# EAGLE design LPC1114FN28_BaseBoard (EAGLE 5.11)
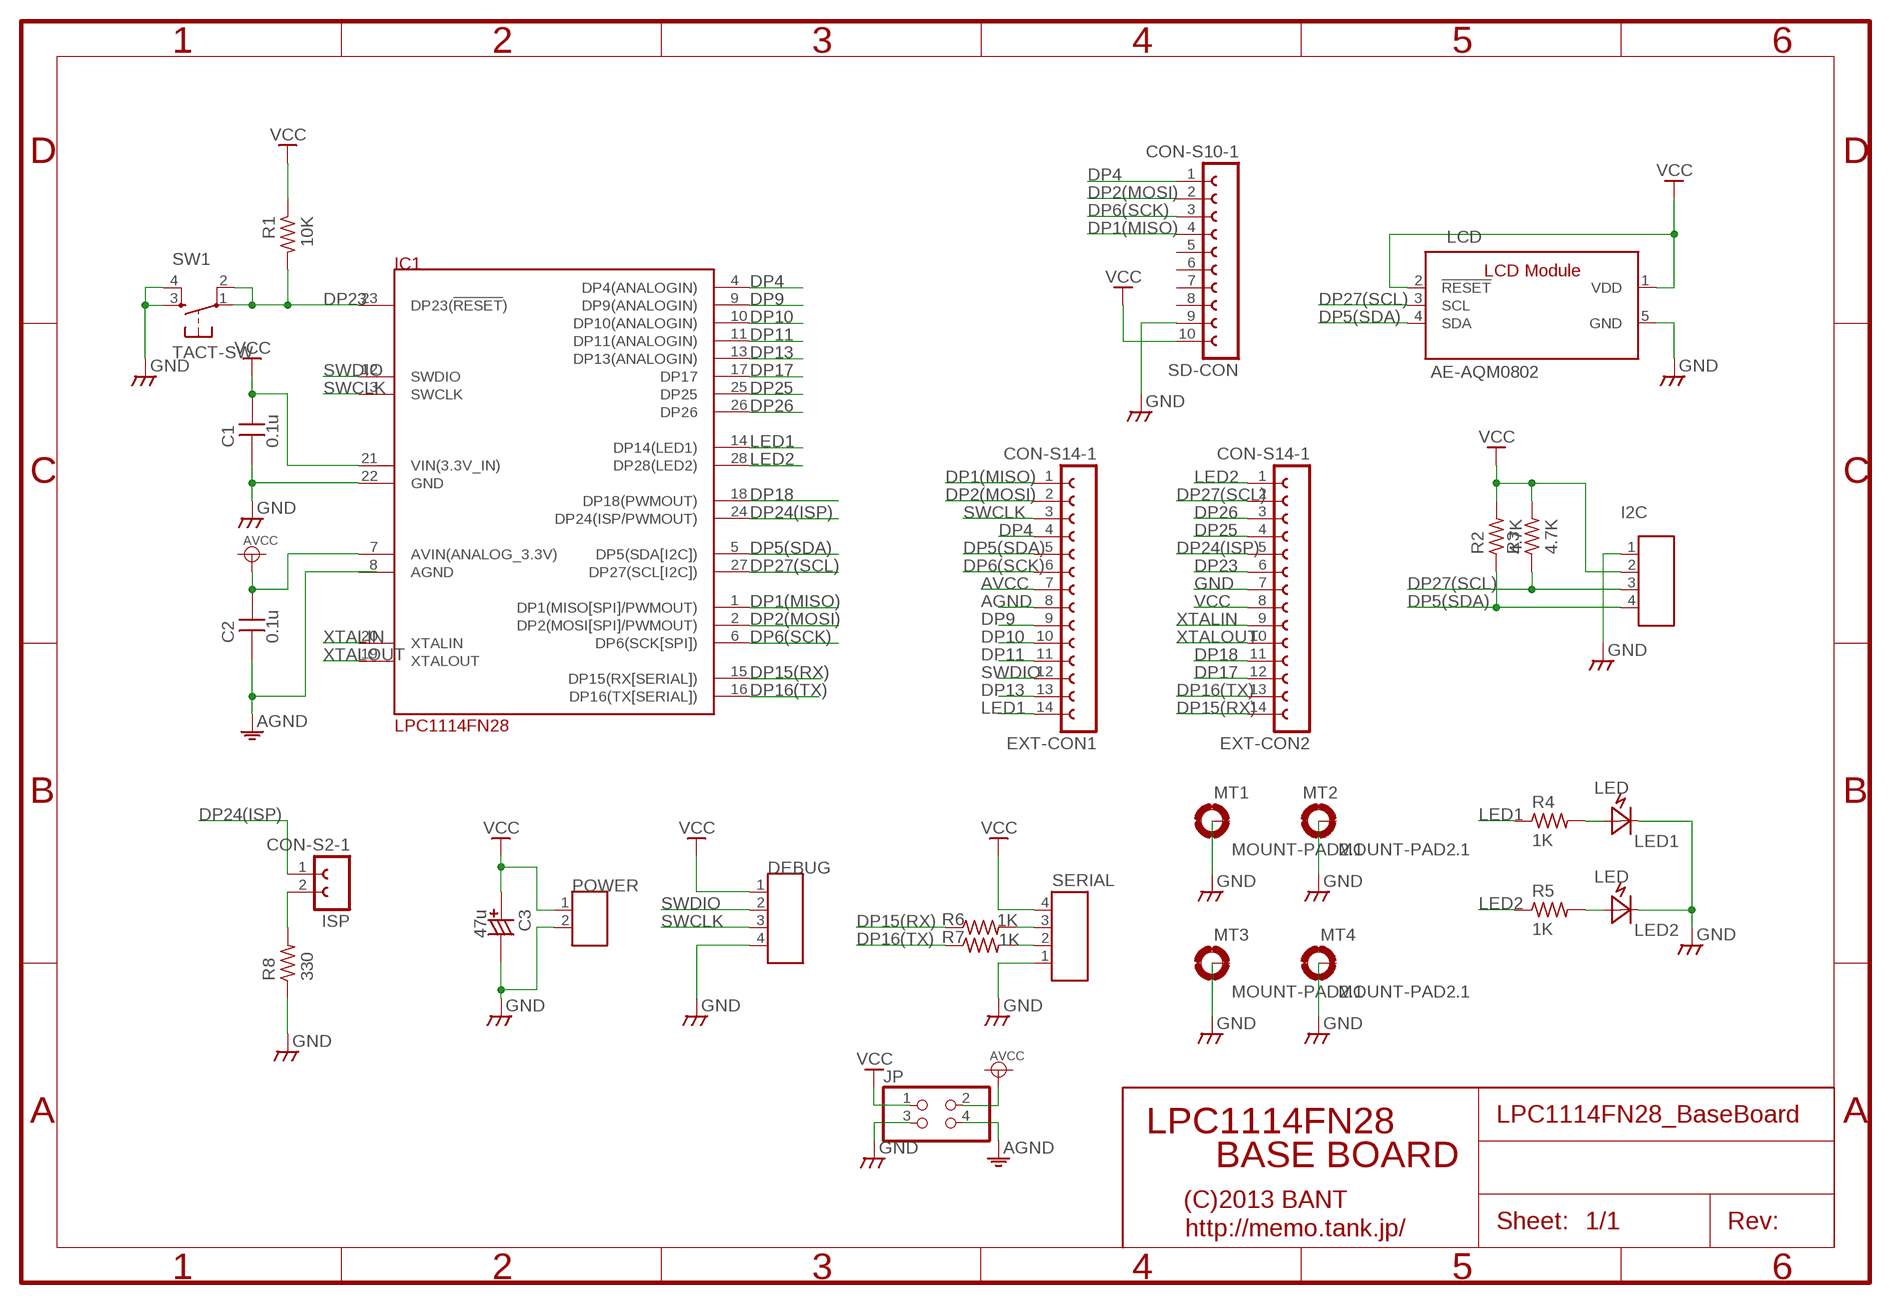
[diagram p0: schematic, sheet 1]

## Parts
C1  0.1u  CAPDIP_1  [CAP_DIP_1]
C2  0.1u  CAPDIP_1  [CAP_DIP_1]
C3  47u  CCAP6.5  [CCAP_6.5]
DEBUG  CON_4P  [CON_HRS_DIP_4]
EXT-CON1  CON-S14-1  [CON-S14-1]
EXT-CON2  CON-S14-1  [CON-S14-1]
I2C  CON_4P  [CON_HRS_DIP_4]
IC1  LPC1114FN28  [DIL28]
ISP  CON-S2-1  [CON-S2-1]
JP  PINHD-2X02_2.54  [2X02]
LCD  AE-AQM0802  [AE-AQM0802]
LED1  LED  [LED_3MM_VIRT_2]
LED2  LED  [LED_3MM_VIRT_2]
MT1  MOUNT-PAD2.1  [PAD-2.1]
MT2  MOUNT-PAD2.1  [PAD-2.1]
MT3  MOUNT-PAD2.1  [PAD-2.1]
MT4  MOUNT-PAD2.1  [PAD-2.1]
POWER  CON_2P  [CON_HRS_DIP_2]
R1  10K  R0.125W_4P  [R_0.125W_4]
R2  4.7K  R0.125W_4P  [R_0.125W_4]
R3  4.7K  R0.125W_4P  [R_0.125W_4]
R4  1K  R0.125W_4P  [R_0.125W_4]
R5  1K  R0.125W_4P  [R_0.125W_4]
R6  1K  R0.125W_4P  [R_0.125W_4]
R7  1K  R0.125W_4P  [R_0.125W_4]
R8  330  R0.125W_4P  [R_0.125W_4]
SD-CON  CON-S10-1  [CON-S10-1]
SERIAL  CON_4P  [CON_HRS_DIP_4]
SW1  TACT-SW  [B3F-10X]

## Nets
AGND: C2.1 EXT-CON1.8 IC1.8(AGND) JP.4
AVCC: C2.2 EXT-CON1.7 IC1.7(AVIN(ANALOG_3.3V)) JP.2
DP1(MISO): EXT-CON1.1 IC1.1(DP1(MISO[SPI]/PWMOUT)) SD-CON.4
DP2(MOSI): EXT-CON1.2 IC1.2(DP2(MOSI[SPI]/PWMOUT)) SD-CON.2
DP4: EXT-CON1.4 IC1.4(DP4(ANALOGIN)) SD-CON.1
DP5(SDA): EXT-CON1.5 I2C.4 IC1.5(DP5(SDA[I2C])) LCD.4(SDA) R2.1
DP6(SCK): EXT-CON1.6 IC1.6(DP6(SCK[SPI])) SD-CON.3
DP9: EXT-CON1.9 IC1.9(DP9(ANALOGIN))
DP10: EXT-CON1.10 IC1.10(DP10(ANALOGIN))
DP11: EXT-CON1.11 IC1.11(DP11(ANALOGIN))
DP13: EXT-CON1.13 IC1.13(DP13(ANALOGIN))
DP15(RX): EXT-CON2.14 IC1.15(DP15(RX[SERIAL])) R6.1
DP16(TX): EXT-CON2.13 IC1.16(DP16(TX[SERIAL])) R7.1
DP17: EXT-CON2.12 IC1.17(DP17)
DP18: EXT-CON2.11 IC1.18(DP18(PWMOUT))
DP23: EXT-CON2.6 IC1.23(DP23(!RESET!)) R1.2 SW1.1(P) SW1.2(P1)
DP24(ISP): EXT-CON2.5 IC1.24(DP24(ISP/PWMOUT)) ISP.1
DP25: EXT-CON2.4 IC1.25(DP25)
DP26: EXT-CON2.3 IC1.26(DP26)
DP27(SCL): EXT-CON2.2 I2C.3 IC1.27(DP27(SCL[I2C])) LCD.3(SCL) R3.1
GND: C1.1 C3.- DEBUG.4 EXT-CON2.7 I2C.1 IC1.22(GND) JP.3 LCD.5(GND) LED1.K LED2.K MT1.B2,1(MOUNT) MT2.B2,1(MOUNT) MT3.B2,1(MOUNT) MT4.B2,1(MOUNT) POWER.2 R8.1 SD-CON.9 SERIAL.1 SW1.3(S) SW1.4(S1)
LED1: EXT-CON1.14 IC1.14(DP14(LED1)) R4.1
LED2: EXT-CON2.1 IC1.28(DP28(LED2)) R5.1
N$2: R6.2 SERIAL.3
N$3: LED1.A R4.2
N$4: LED2.A R5.2
N$5: R7.2 SERIAL.2
N$6: ISP.2 R8.2
SWCLK: DEBUG.3 EXT-CON1.3 IC1.3(SWCLK)
SWDIO: DEBUG.2 EXT-CON1.12 IC1.12(SWDIO)
VCC: C1.2 C3.+ DEBUG.1 EXT-CON2.8 I2C.2 IC1.21(VIN(3.3V_IN)) JP.1 LCD.1(VDD) LCD.2(!RESET) POWER.1 R1.1 R2.2 R3.2 SD-CON.10 SERIAL.4
XTALIN: EXT-CON2.9 IC1.20(XTALIN)
XTALOUT: EXT-CON2.10 IC1.19(XTALOUT)
Unconnected: SD-CON.5 SD-CON.6 SD-CON.7 SD-CON.8

## Notes on the sheet
- LPC1114FN28
- BASE BOARD
- (C)2013 BANT
- http://memo.tank.jp/

## Library data of the parts
C1 C2 = MyLib:CAP: Non polar capacitor
C3 = MyLib:CCAP: Polar capacitor
DEBUG I2C SERIAL = MyLib:CON_4P: 4P Molex Connector
EXT-CON1 EXT-CON2 = bant:CON-S14-1
IC1 = bant:LPC1114FN28
ISP = bant:CON-S2-1
JP = pinheader:PINHD-2X02: PIN HEADER
LCD = akizuki:AE-AQM0802
LED1 LED2 = MyLib:LED: 3mm LED
MT1-MT4 = MyLib:MOUNT-PAD: 2.1mm Mount Pad (Connectable to GND)
POWER = MyLib:CON_2P: 2P Molex Connector
R1-R8 = MyLib:R: General Resiter 1/8W 1/4W 1/2W V/H
SD-CON = bant:CON-S10-1
SW1 = MyLib:TACT-SW: Tacticle Push Switch

## Board
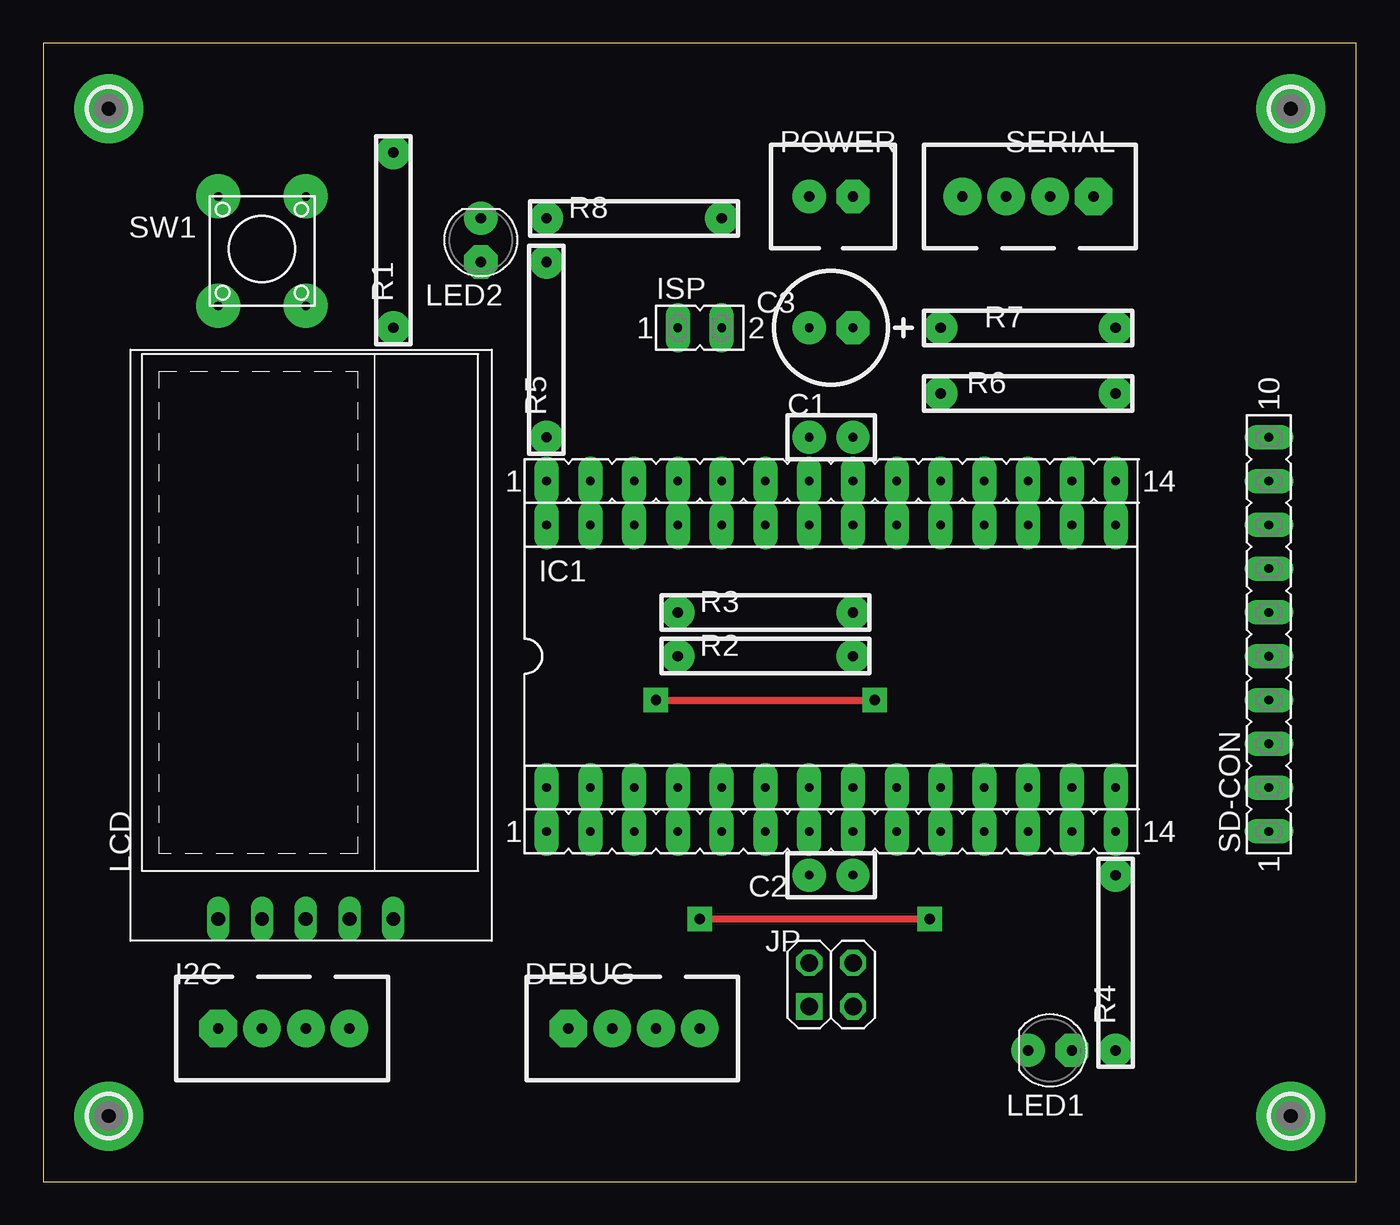
[diagram p1: board, top side]
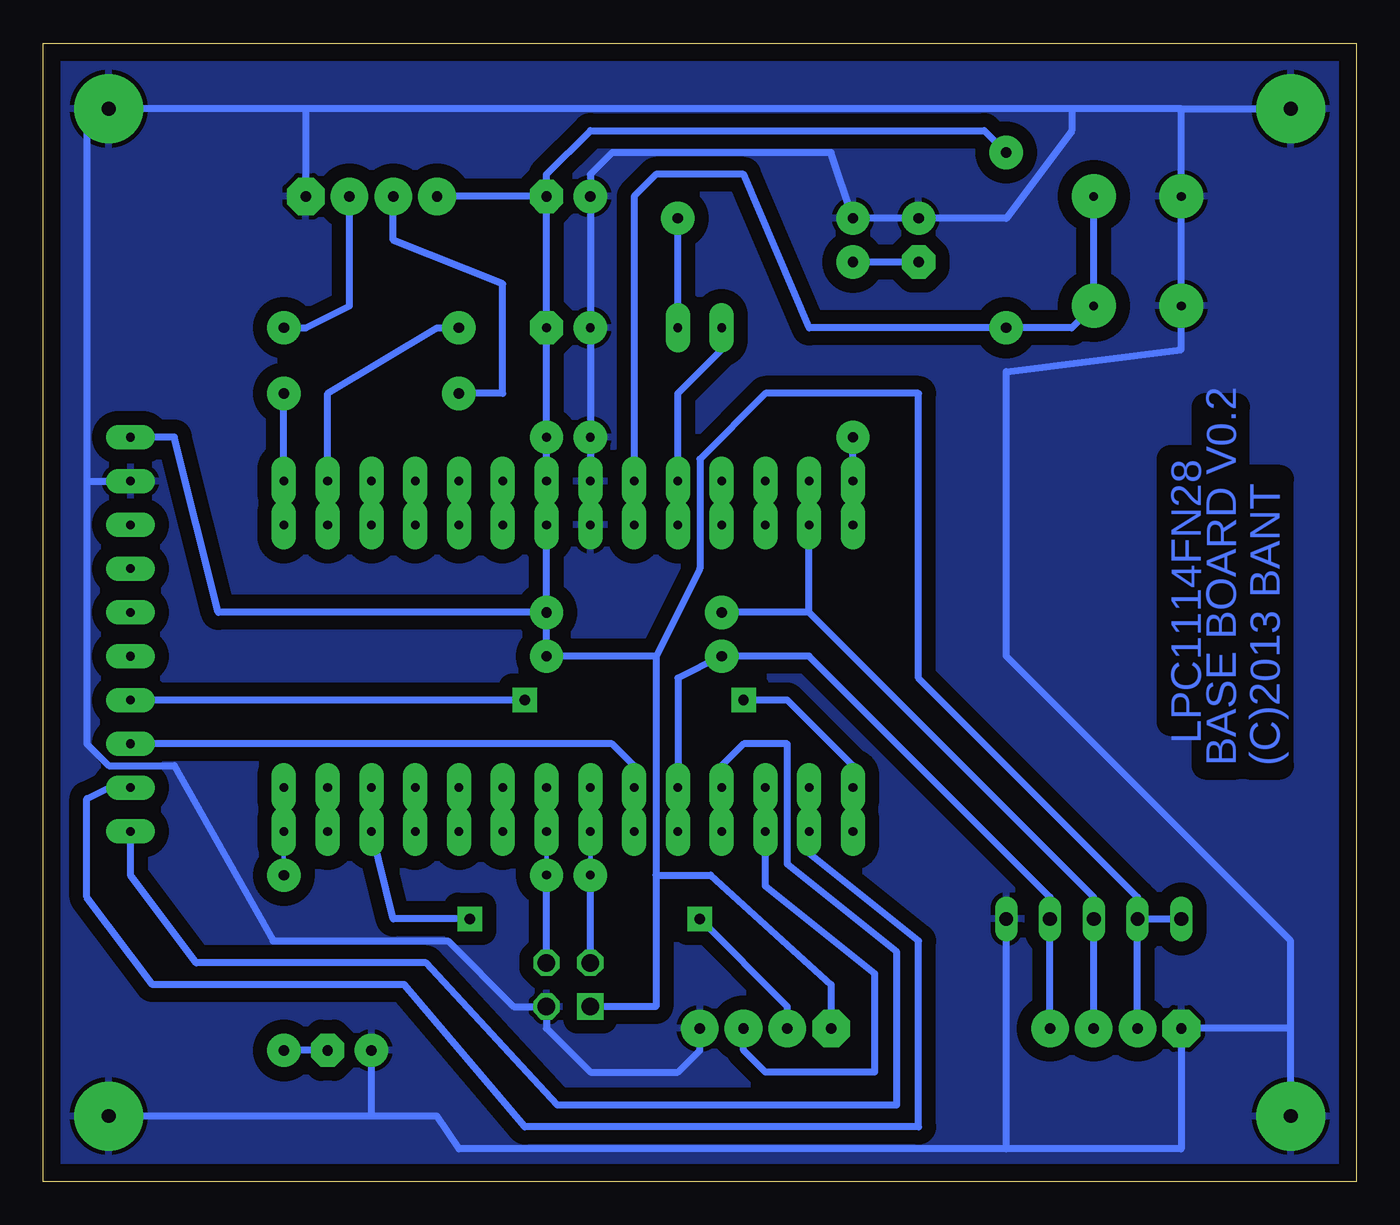
[diagram p2: board, bottom side, seen from below]

Size 76.2 x 66.04 mm. Coordinates in mm from the lower left corner, seen from the top.
Outline: 0,0 76.2,0 76.2,66.04 0,66.04 0,0
Copper layers (1*16): Top 0.035mm / dielectric 1.5mm / Bottom 0.035mm
Design rules "default": minimum track width 10mil, minimum drill 24mil, track to track 8mil, track to pad 8mil, pad to pad 8mil, via to via 8mil, smd to smd 8mil, copper to edge 40mil, drill to drill 8mil, minimum pad ring 10mil, minimum via ring 8mil, stop-mask expansion 4mil, vias tented up to drill 0mil, thermal gap 10mil

### Footprints (pad centres in the part's own frame; a part is rotated, then mirrored left to right if it is on the bottom)
CAP_DIP_1 = drill 0.5 pad 1.93 round: 1 -1.27,0; 2 1.27,0
CCAP_6.5 = drill 0.5 pad 1.93 octagon: + -1.27,0 | drill 0.5 pad 1.93 round: - 1.27,0
CON_HRS_DIP_4 = drill 0.6 pad 2.184 octagon: 1 -3.81,0 | drill 0.6 pad 2.184 round: 2 -1.27,0; 3 1.27,0; 4 3.81,0
CON-S14-1 = drill 0.5 pad 1.422 long: 1 -16.51,0; 2 -13.97,0; 3 -11.43,0; 4 -8.89,0; 5 -6.35,0; 6 -3.81,0; 7 -1.27,0; 8 1.27,0; 9 3.81,0; 10 6.35,0; 11 8.89,0; 12 11.43,0; 13 13.97,0; 14 16.51,0
DIL28 = drill 0.5 pad 1.422 long: 1 -15.24,-7.62; 2 -12.7,-7.62; 3 -10.16,-7.62; 4 -7.62,-7.62; 5 -5.08,-7.62; 6 -2.54,-7.62; 7 0,-7.62; 8 2.54,-7.62; 9 5.08,-7.62; 10 7.62,-7.62; 11 10.16,-7.62; 12 12.7,-7.62; 13 15.24,-7.62; 14 17.78,-7.62; 15 17.78,7.62; 16 15.24,7.62; 17 12.7,7.62; 18 10.16,7.62; 19 7.62,7.62; 20 5.08,7.62; 21 2.54,7.62; 22 0,7.62; 23 -2.54,7.62; 24 -5.08,7.62; 25 -7.62,7.62; 26 -10.16,7.62; 27 -12.7,7.62; 28 -15.24,7.62
CON-S2-1 = drill 0.5 pad 1.422 long: 1 -1.27,0; 2 1.27,0
2X02 = drill 1.016 square: 1 -1.27,-1.27 | drill 1.016 octagon: 2 -1.27,1.27; 3 1.27,-1.27; 4 1.27,1.27
AE-AQM0802 = drill 0.8 long: 1 -17.78,3.81; 2 -17.78,1.27; 3 -17.78,-1.27; 4 -17.78,-3.81; 5 -17.78,-6.35
LED_3MM_VIRT_2 = drill 0.6 pad 1.93 octagon: A 0,1.27 | drill 0.6 pad 1.93 round: K 0,-1.27
PAD-2.1 = drill 0.8 pad 4 round: B2,1 0,0
CON_HRS_DIP_2 = drill 0.6 pad 1.93 octagon: 1 -1.27,0 | drill 0.6 pad 1.93 round: 2 1.27,0
R_0.125W_4 = drill 0.6 pad 1.93 round: 1 -5.08,0; 2 5.08,0
CON-S10-1 = drill 0.5 pad 1.422 long: 1 1.27,1.27; 2 3.81,1.27; 3 6.35,1.27; 4 8.89,1.27; 5 11.43,1.27; 6 13.97,1.27; 7 16.51,1.27; 8 19.05,1.27; 9 21.59,1.27; 10 24.13,1.27
B3F-10X = drill 0.5 pad 2.54 round: 1 -1.27,2.54; 2 5.08,2.54; 3 -1.27,-2.54; 4 5.08,-2.54

### Placement (x,y rotation side)
C1  45.72,43.18 0 top
C2  45.72,17.78 180 top
C3  45.72,49.53 180 top
DEBUG  34.29,8.89 0 top
EXT-CON1  45.72,20.32 0 top
EXT-CON2  45.72,40.64 0 top
I2C  13.97,8.89 0 top
IC1  44.45,30.48 0 top
ISP  38.1,49.53 0 top
JP  45.72,11.43 0 top
LCD  13.97,33.02 90 top
LED1  58.42,7.62 270 top
LED2  25.4,54.61 180 top
MT1  72.39,3.81 0 top
MT2  72.39,62.23 0 top
MT3  3.81,62.23 0 top
MT4  3.81,3.81 0 top
POWER  45.72,57.15 180 top
R1  20.32,54.61 270 top
R2  41.91,30.48 0 top
R3  41.91,33.02 0 top
R4  62.23,12.7 270 top
R5  29.21,48.26 90 top
R6  57.15,45.72 180 top
R7  57.15,49.53 0 top
R8  34.29,55.88 0 top
SD-CON  72.39,19.05 90 top
SERIAL  57.15,57.15 180 top
SW1  12.7,55.88 270 top

### Tracks (layer width: path | path; a pad name or v marks a point on that pad's centre or on a via)
AGND
  Bottom 0.254: C2.1 EXT-CON1.8
  Bottom 0.406: EXT-CON1.8 IC1.8 | JP.4 C2.1
AVCC
  Bottom 0.254: C2.2 EXT-CON1.7
  Bottom 0.406: EXT-CON1.7 IC1.7 | JP.2 C2.2
DP1(MISO)  (via drill 0.6 pad 1.42)
  Top 0.406: v35.56,27.94 v48.26,27.94
  Bottom 0.406: EXT-CON1.1 IC1.1 29.21,24.13 33.02,27.94 v35.56,27.94 | v48.26,27.94 SD-CON.4
DP2(MOSI)
  Bottom 0.254: 31.75,19.05 EXT-CON1.2
  Bottom 0.406: EXT-CON1.2 IC1.2 | SD-CON.2 72.39,22.86 73.66,22.23 73.66,16.51 69.85,11.43 55.24,11.43 48.26,3.17 25.4,3.17 25.4,13.97 31.75,19.05
DP4
  Bottom 0.406: EXT-CON1.4 IC1.4 36.83,24.13 35.56,25.4 33.02,25.4 33.02,18.41 26.67,13.34 26.67,4.45 46.35,4.45 53.98,12.7 67.31,12.7 71.12,17.78 SD-CON.1
DP5(SDA)
  Bottom 0.406: I2C.4 LCD.4 17.78,16.51 31.75,30.48 R2.1 39.37,29.21 IC1.5 EXT-CON1.5
DP6(SCK)
  Bottom 0.254: IC1.6 41.91,24.13
  Bottom 0.406: EXT-CON1.6 IC1.6 | SD-CON.3 43.18,25.4 41.91,24.13
DP9
  Bottom 0.406: EXT-CON1.9 IC1.9
DP10
  Bottom 0.406: EXT-CON1.10 IC1.10
DP11
  Bottom 0.406: EXT-CON1.11 IC1.11
DP13
  Bottom 0.406: EXT-CON1.13 IC1.13
DP15(RX)
  Bottom 0.406: IC1.15 EXT-CON2.14 R6.1
DP16(TX)
  Bottom 0.406: IC1.16 EXT-CON2.13 59.69,45.72 53.34,49.53 R7.1
DP17
  Bottom 0.406: IC1.17 EXT-CON2.12
DP18
  Bottom 0.406: IC1.18 EXT-CON2.11
DP23
  Bottom 0.254: EXT-CON2.6 41.91,41.91
  Bottom 0.406: IC1.23 EXT-CON2.6 41.91,57.15 40.64,58.42 35.56,58.42 31.75,49.53 R1.2 16.51,49.53 SW1.2 SW1.1
DP24(ISP)
  Bottom 0.406: IC1.24 EXT-CON2.5 39.37,45.72 36.83,48.26 ISP.1
DP25
  Bottom 0.406: IC1.25 EXT-CON2.4
DP26
  Bottom 0.406: IC1.26 EXT-CON2.3
DP27(SCL)
  Bottom 0.406: I2C.3 LCD.3 15.24,16.51 31.75,33.02 | EXT-CON2.2 IC1.27 31.75,33.02 | 31.75,33.02 R3.1
GND
  Bottom 0.406: DEBUG.4 38.1,7.62 39.37,6.35 44.45,6.35 46.99,8.89 JP.3 48.9,10.16 52.7,13.97 62.87,13.97 68.58,24.13 72.39,24.13 73.66,25.4 73.66,40.64 | IC1.22 EXT-CON2.7 C1.1 C3.- POWER.2 44.45,58.42 43.18,59.69 30.48,59.69 R8.1 LED2.K 20.32,55.88 16.51,60.96 16.51,62.23 | 10.16,62.23 SW1.3 SW1.4 10.16,48.26 20.32,46.99 20.32,30.48 3.81,13.97 3.81,8.89 | 10.16,62.23 16.51,62.23 | 16.51,62.23 60.96,62.23 | 60.96,62.23 MT2.B2,1 73.66,62.23 73.66,40.64 | 57.15,3.81 LED1.K | 20.32,1.91 10.16,1.91 I2C.1 3.81,8.89 | 10.16,62.23 MT3.B2,1 | 20.32,1.91 LCD.5 | MT4.B2,1 3.81,8.89 | 20.32,1.91 52.07,1.91 53.34,3.81 MT1.B2,1 | 73.66,40.64 SD-CON.9 | 60.96,62.23 SERIAL.1
  pour Bottom (isolate 0.813): 0,66.04 0,0 76.2,0 76.2,66.04
LED1
  Bottom 0.254: R4.1 EXT-CON1.14
  Bottom 0.406: EXT-CON1.14 IC1.14
LED2
  Bottom 0.406: IC1.28 EXT-CON2.1 R5.1
N$2
  Bottom 0.406: R6.2 49.53,45.72 49.53,52.07 55.88,54.61 SERIAL.3
N$3
  Bottom 0.406: LED1.A R4.2
N$4
  Bottom 0.406: LED2.A R5.2
N$5
  Bottom 0.406: R7.2 60.96,49.53 58.42,50.8 SERIAL.2
N$6
  Bottom 0.406: ISP.2 R8.2
SWCLK
  Bottom 0.406: IC1.3 EXT-CON1.3 34.29,17.14 27.94,12.06 27.94,6.35 34.29,6.35 35.56,7.62 DEBUG.3
SWDIO  (via drill 0.6 pad 1.42)
  Top 0.406: v38.1,15.24 v51.44,15.24
  Bottom 0.406: IC1.12 EXT-CON1.12 55.88,15.24 v51.44,15.24 | v38.1,15.24 33.02,10.16 DEBUG.2
VCC
  Bottom 0.406: POWER.1 C3.+ C1.2 EXT-CON2.8 IC1.21 R3.2 | R1.1 21.59,60.96 44.45,60.96 46.99,58.42 POWER.1 | 40.64,17.78 37.47,17.78 30.48,11.43 DEBUG.1 | LCD.2 LCD.1 | I2C.2 LCD.2 | LCD.2 12.7,16.51 25.4,29.21 25.4,45.72 34.29,45.72 38.1,41.91 38.1,35.56 40.64,30.48 | 40.64,30.48 40.64,17.78 | JP.1 40.64,10.16 40.64,17.78 | R3.2 66.04,33.02 68.58,43.18 SD-CON.10 | R3.2 R2.2 40.64,30.48 | POWER.1 SERIAL.4
XTALIN
  Bottom 0.406: IC1.20 EXT-CON2.9
XTALOUT
  Bottom 0.406: IC1.19 EXT-CON2.10

### Text on the board
Bottom: LPC1114FN28 | (C)2013 BANT | BASE BOARD V0.2